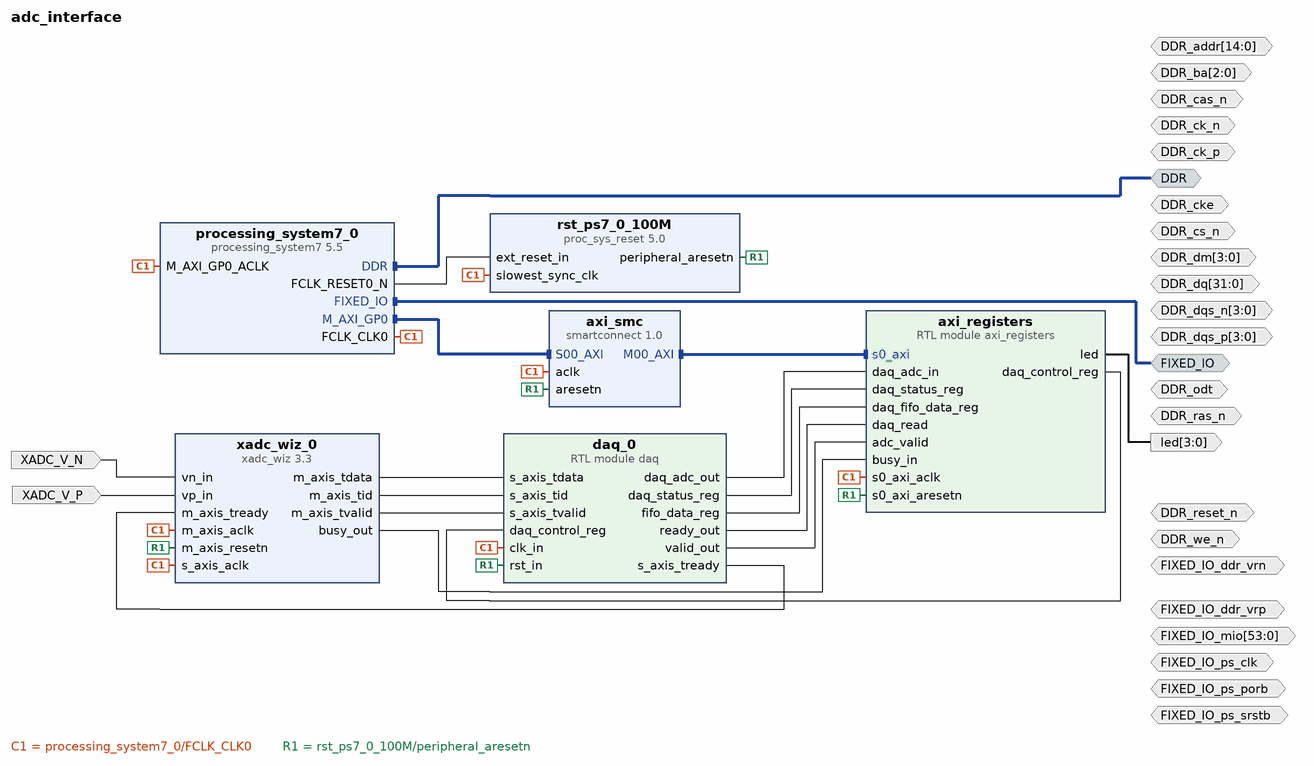
[diagram p0: block diagram of the top level]
# Vivado block design adc_interface, xc7z020clg400-1, Vivado 2021.1
create_bd_design adc_interface

create_bd_intf_port -mode Master -vlnv xilinx.com:interface:ddrx_rtl:1.0 DDR
create_bd_intf_port -mode Master -vlnv xilinx.com:display_processing_system7:fixedio_rtl:1.0 FIXED_IO
create_bd_port -dir O -from 3 -to 0 led
create_bd_port -dir IO DDR_cas_n
create_bd_port -dir IO DDR_cke
create_bd_port -dir IO -type clk DDR_ck_n
create_bd_port -dir IO -type clk DDR_ck_p
create_bd_port -dir IO DDR_cs_n
create_bd_port -dir IO -type rst DDR_reset_n
create_bd_port -dir IO DDR_odt
create_bd_port -dir IO DDR_ras_n
create_bd_port -dir IO DDR_we_n
create_bd_port -dir IO -from 2 -to 0 DDR_ba
create_bd_port -dir IO -from 14 -to 0 DDR_addr
create_bd_port -dir IO -from 3 -to 0 DDR_dm
create_bd_port -dir IO -from 31 -to 0 DDR_dq
create_bd_port -dir IO -from 3 -to 0 DDR_dqs_n
create_bd_port -dir IO -from 3 -to 0 DDR_dqs_p
create_bd_port -dir IO -from 53 -to 0 FIXED_IO_mio
create_bd_port -dir IO FIXED_IO_ddr_vrn
create_bd_port -dir IO FIXED_IO_ddr_vrp
create_bd_port -dir IO FIXED_IO_ps_srstb
create_bd_port -dir IO FIXED_IO_ps_clk
create_bd_port -dir IO FIXED_IO_ps_porb
create_bd_port -dir I XADC_V_P
create_bd_port -dir I XADC_V_N

create_bd_cell -type ip -vlnv xilinx.com:ip:smartconnect:1.0 axi_smc
set_property -dict {CONFIG.NUM_MI 4 CONFIG.NUM_SI 1} [get_bd_cells axi_smc]
create_bd_cell -type ip -vlnv xilinx.com:ip:processing_system7:5.5 processing_system7_0
set_property -dict [list \
  CONFIG.PCW_APU_PERIPHERAL_FREQMHZ 650 \
  CONFIG.PCW_CRYSTAL_PERIPHERAL_FREQMHZ 50 \
  CONFIG.PCW_ENET0_ENET0_IO {MIO 16 .. 27} \
  CONFIG.PCW_ENET0_GRP_MDIO_ENABLE 1 \
  CONFIG.PCW_ENET0_GRP_MDIO_IO {MIO 52 .. 53} \
  CONFIG.PCW_ENET0_PERIPHERAL_ENABLE 1 \
  CONFIG.PCW_ENET0_RESET_ENABLE 1 \
  CONFIG.PCW_ENET0_RESET_IO {MIO 9} \
  CONFIG.PCW_ENET_RESET_ENABLE 1 \
  CONFIG.PCW_ENET_RESET_SELECT {Share reset pin} \
  CONFIG.PCW_FPGA0_PERIPHERAL_FREQMHZ 100 \
  CONFIG.PCW_FPGA1_PERIPHERAL_FREQMHZ 50 \
  CONFIG.PCW_GPIO_MIO_GPIO_ENABLE 1 \
  CONFIG.PCW_GPIO_MIO_GPIO_IO MIO \
  CONFIG.PCW_I2C_RESET_ENABLE 1 \
  CONFIG.PCW_M_AXI_GP0_FREQMHZ 10 \
  CONFIG.PCW_PERIPHERAL_BOARD_PRESET None \
  CONFIG.PCW_PRESET_BANK1_VOLTAGE {LVCMOS 1.8V} \
  CONFIG.PCW_QSPI_GRP_FBCLK_ENABLE 1 \
  CONFIG.PCW_QSPI_GRP_FBCLK_IO {MIO 8} \
  CONFIG.PCW_QSPI_GRP_SINGLE_SS_ENABLE 1 \
  CONFIG.PCW_QSPI_GRP_SINGLE_SS_IO {MIO 1 .. 6} \
  CONFIG.PCW_QSPI_PERIPHERAL_ENABLE 1 \
  CONFIG.PCW_QSPI_QSPI_IO {MIO 1 .. 6} \
  CONFIG.PCW_SD0_GRP_CD_ENABLE 1 \
  CONFIG.PCW_SD0_GRP_CD_IO {MIO 47} \
  CONFIG.PCW_SD0_GRP_WP_ENABLE 0 \
  CONFIG.PCW_SD0_PERIPHERAL_ENABLE 1 \
  CONFIG.PCW_SD0_SD0_IO {MIO 40 .. 45} \
  CONFIG.PCW_SDIO_PERIPHERAL_FREQMHZ 50 \
  CONFIG.PCW_SINGLE_QSPI_DATA_MODE x4 \
  CONFIG.PCW_UART0_PERIPHERAL_ENABLE 1 \
  CONFIG.PCW_UART0_UART0_IO {MIO 14 .. 15} \
  CONFIG.PCW_UART1_PERIPHERAL_ENABLE 0 \
  CONFIG.PCW_UART_PERIPHERAL_FREQMHZ 100 \
  CONFIG.PCW_UIPARAM_DDR_BUS_WIDTH {16 Bit} \
  CONFIG.PCW_UIPARAM_DDR_FREQ_MHZ 525 \
  CONFIG.PCW_UIPARAM_DDR_PARTNO {MT41J256M16 RE-125} \
  CONFIG.PCW_USB0_PERIPHERAL_ENABLE 1 \
  CONFIG.PCW_USB0_RESET_ENABLE 1 \
  CONFIG.PCW_USB0_RESET_IO {MIO 46} \
  CONFIG.PCW_USB0_USB0_IO {MIO 28 .. 39} \
  CONFIG.PCW_USB_RESET_ENABLE 1 \
  CONFIG.PCW_USB_RESET_SELECT {Share reset pin} \
] [get_bd_cells processing_system7_0]
# 497 more settings of processing_system7_0 are not shown: defaults, MIO pin electricals, DDR timing, and values the tool derives
create_bd_cell -type ip -vlnv xilinx.com:ip:proc_sys_reset:5.0 rst_ps7_0_100M
create_bd_cell -type ip -vlnv xilinx.com:ip:xadc_wiz:3.3 xadc_wiz_0
set_property -dict [list \
  CONFIG.ADC_OFFSET_AND_GAIN_CALIBRATION false \
  CONFIG.BIPOLAR_OPERATION true \
  CONFIG.BIPOLAR_VP_VN true \
  CONFIG.CHANNEL_ENABLE_VP_VN true \
  CONFIG.ENABLE_AXI4STREAM true \
  CONFIG.ENABLE_CALIBRATION_AVERAGING false \
  CONFIG.ENABLE_RESET false \
  CONFIG.ENABLE_VCCDDRO_ALARM false \
  CONFIG.ENABLE_VCCPAUX_ALARM false \
  CONFIG.ENABLE_VCCPINT_ALARM false \
  CONFIG.EXTERNAL_MUX_CHANNEL VP_VN \
  CONFIG.INTERFACE_SELECTION None \
  CONFIG.OT_ALARM false \
  CONFIG.SENSOR_OFFSET_AND_GAIN_CALIBRATION false \
  CONFIG.SEQUENCER_MODE Continuous \
  CONFIG.SINGLE_CHANNEL_ACQUISITION_TIME false \
  CONFIG.SINGLE_CHANNEL_ENABLE_CALIBRATION true \
  CONFIG.SINGLE_CHANNEL_SELECTION VP_VN \
  CONFIG.USER_TEMP_ALARM true \
  CONFIG.VCCAUX_ALARM false \
  CONFIG.VCCINT_ALARM false \
  CONFIG.XADC_STARUP_SELECTION channel_sequencer \
] [get_bd_cells xadc_wiz_0]
create_bd_cell -type module -reference axi_registers axi_registers
create_bd_cell -type module -reference daq daq_0

# ---- connections ----

connect_bd_intf_net [get_bd_intf_pins axi_smc/M00_AXI] [get_bd_intf_pins axi_registers/s0_axi]
connect_bd_intf_net [get_bd_intf_ports DDR] [get_bd_intf_pins processing_system7_0/DDR]
connect_bd_intf_net [get_bd_intf_ports FIXED_IO] [get_bd_intf_pins processing_system7_0/FIXED_IO]
connect_bd_intf_net [get_bd_intf_pins processing_system7_0/M_AXI_GP0] [get_bd_intf_pins axi_smc/S00_AXI]
connect_bd_net [get_bd_ports XADC_V_N] [get_bd_pins xadc_wiz_0/vn_in]
connect_bd_net [get_bd_ports XADC_V_P] [get_bd_pins xadc_wiz_0/vp_in]
connect_bd_net -net axi_registers_0_led [get_bd_pins axi_registers/led] [get_bd_ports led]
connect_bd_net [get_bd_pins axi_registers/daq_control_reg] [get_bd_pins daq_0/daq_control_reg]
connect_bd_net [get_bd_pins daq_0/daq_adc_out] [get_bd_pins axi_registers/daq_adc_in]
connect_bd_net [get_bd_pins daq_0/daq_status_reg] [get_bd_pins axi_registers/daq_status_reg]
connect_bd_net [get_bd_pins daq_0/fifo_data_reg] [get_bd_pins axi_registers/daq_fifo_data_reg]
connect_bd_net [get_bd_pins daq_0/ready_out] [get_bd_pins axi_registers/daq_read]
connect_bd_net [get_bd_pins daq_0/s_axis_tready] [get_bd_pins xadc_wiz_0/m_axis_tready]
connect_bd_net [get_bd_pins daq_0/valid_out] [get_bd_pins axi_registers/adc_valid]
connect_bd_net [get_bd_pins processing_system7_0/FCLK_CLK0] \
  [get_bd_pins processing_system7_0/M_AXI_GP0_ACLK] [get_bd_pins axi_smc/aclk] [get_bd_pins rst_ps7_0_100M/slowest_sync_clk] \
  [get_bd_pins xadc_wiz_0/m_axis_aclk] [get_bd_pins xadc_wiz_0/s_axis_aclk] [get_bd_pins axi_registers/s0_axi_aclk] \
  [get_bd_pins daq_0/clk_in]
connect_bd_net [get_bd_pins processing_system7_0/FCLK_RESET0_N] [get_bd_pins rst_ps7_0_100M/ext_reset_in]
connect_bd_net [get_bd_pins rst_ps7_0_100M/peripheral_aresetn] \
  [get_bd_pins axi_smc/aresetn] [get_bd_pins xadc_wiz_0/m_axis_resetn] [get_bd_pins axi_registers/s0_axi_aresetn] \
  [get_bd_pins daq_0/rst_in]
connect_bd_net [get_bd_pins xadc_wiz_0/busy_out] [get_bd_pins axi_registers/busy_in]
connect_bd_net [get_bd_pins xadc_wiz_0/m_axis_tdata] [get_bd_pins daq_0/s_axis_tdata]
connect_bd_net [get_bd_pins xadc_wiz_0/m_axis_tid] [get_bd_pins daq_0/s_axis_tid]
connect_bd_net [get_bd_pins xadc_wiz_0/m_axis_tvalid] [get_bd_pins daq_0/s_axis_tvalid]
set_property HDL_ATTRIBUTE.BMM_INFO_PROCESSOR {arm > pynqz2_ps_example bram} [get_bd_cells processing_system7_0]
set_property HDL_ATTRIBUTE.KEEP_HIERARCHY yes [get_bd_cells processing_system7_0]

# ---- address map ----
assign_bd_address -offset 0x40000000 -range 1G -target_address_space [get_bd_addr_spaces processing_system7_0/Data] [get_bd_addr_segs axi_registers/s0_axi/reg0]

validate_bd_design
save_bd_design
